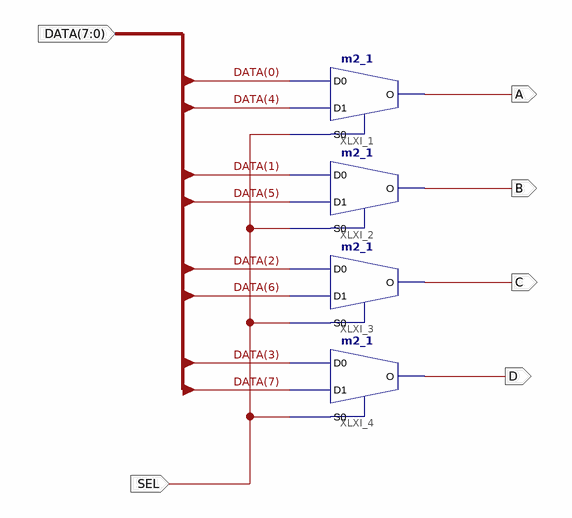
[diagram p0: schematic sheet 1]
// Xilinx ISE schematic MUX4.sch (spartan6) as structural Verilog: 4 symbols, 6 ports
module MUX4 (
  input  SEL,
  input  [7:0] DATA,
  output A,
  output B,
  output C,
  output D
);

  m2_1 XLXI_1 (.D0(DATA[0]), .D1(DATA[4]), .S0(SEL), .O(A));
  m2_1 XLXI_2 (.D0(DATA[1]), .D1(DATA[5]), .S0(SEL), .O(B));
  m2_1 XLXI_3 (.D0(DATA[2]), .D1(DATA[6]), .S0(SEL), .O(C));
  m2_1 XLXI_4 (.D0(DATA[3]), .D1(DATA[7]), .S0(SEL), .O(D));
endmodule
